# Altium schematic sheet LDR_Module.SchDoc
size A4; SheetNumber: 1; SheetTotal: 1
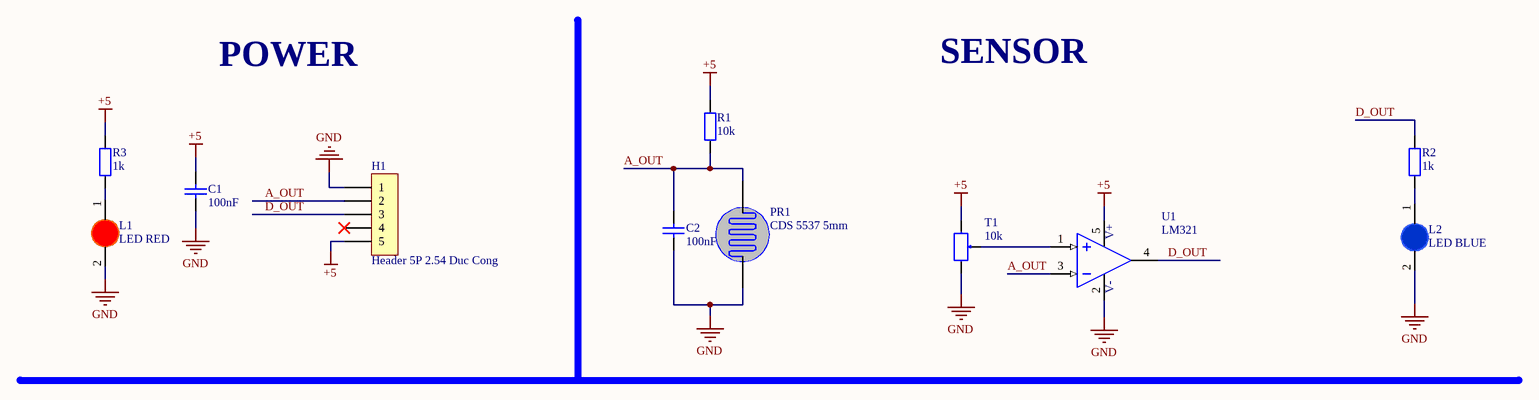
[diagram p0: LDR_Module.SchDoc]

## Parts
C1  100nF  [tu 0603]
C2  100nF  [tu 0603]
H1  Header 5P 2.54 Duc Cong  [Header 5P DC 2.54]
L1  LED RED  [LED-0805-Red]
L2  LED BLUE  [LED-0805-Blue]
PR1  CDS 5537 5mm  [Quang Tro]
R1  10k  [tro smd 0603]
R2  1k  [tro smd 0603]
R3  1k  [tro smd 0603]
T1  10k  [Bien Tro Vi Chinh Dung]
U1  LM321  [sot23-5]

## Nets
+5: C1.1 H1.5 R1.2 R3.2 T1.3 U1.5(V+)
GND: C1.2 C2.2 H1.1 L1.2(K) L2.2(K) PR1.1 T1.1 U1.2(V-)
A_OUT: C2.1 H1.2 PR1.2 R1.1 U1.3(IN-)
D_OUT: H1.3 R2.2 U1.4(-V)
NetL1_1: L1.1(A) R3.1
NetL2_1: L2.1(A) R2.1
NetT1_2: T1.2 U1.1(IN+)

Not connected (* = marked no-connect by the designer): H1 4*

## Notes on the sheet
- POWER
- SENSOR

## Library data of the parts
C1 C2 = Tu 0603 104 50V 10%: Dán; Don_Vi: Con; So_Chan: 2; Ten_Linh_Kien: Tụ 0603 104-100nF 10% 50V; Ma_Hang: MH004568; Chung_Loai: Dán; Kieu_Chan: *
H1 = Header 5P 2.54 Duc Cong: Cắm; Ten_Linh_Kien: Header 5P XH2.54-5P Đực Cong; Don_Vi: Con; Ma_Hang: MH001308; Chung_Loai: Cắm
L1 = LED 0805 Do: Dán; Don_Vi: Con; Ma_Hang: MH000897; Ten_Linh_Kien: LED 0805 Màu Đỏ (Red); Ghi_Chu: *; Kieu_Chan: *; Chung_Loai: Dán
L2 = LED 0805 Xanh Duong: Dán; Don_Vi: Con; Ma_Hang: MH002327; Ten_Linh_Kien: LED 0805 Màu Xanh Dương (Blue); Ghi_Chu: *; Kieu_Chan: *; Chung_Loai: Dán
PR1 = Quang Tro: Photoresistor; Creator: Bien Nguyen
R1 = Tro 0603 1% 10k: Dán; Don_Vi: Con; So_Chan: 2; Ten_Linh_Kien: Trở 0603 1% 10k; Ma_Hang: MH006333; Chung_Loai: Dán; Kieu_Chan: *
R2 R3 = Tro 0603 1% 1k: Dán; So_Chan: 2; Don_Vi: Con; Ten_Linh_Kien: Trở 0603 1% 1k; Ma_Hang: MH006334; Chung_Loai: Dán; Kieu_Chan: *
T1 = Bien Tro Tinh Chinh 10K Dung: Cắm; Ma_Hang: MH003232; Ten_Linh_Kien: Biến Trở VR 103-10K 3296W; Don_Vi: Con; Kieu_Chan: *; Chung_Loai: Cắm; Ghi_Chu: *
U1 = LM321: Opamp